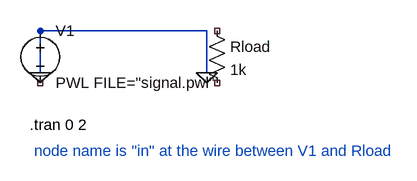
[diagram p0: schematic wav_source.asc]
wav_source.asc, the LTspice schematic file:
Version 4
SHEET 1 880 680
WIRE 224 176 96 176
WIRE 352 176 224 176
WIRE 96 240 96 176
WIRE 352 240 352 176
FLAG 96 240 0
SYMBOL voltage 96 160 R0
SYMATTR InstName V1
SYMATTR Value PWL FILE="signal.pwl"
SYMBOL res 352 160 R0
SYMATTR InstName Rload
SYMATTR Value 1k
FLAG 352 240 0
TEXT 80 320 Left 2 !.tran 0 2
TEXT 80 360 Left 2 ; node name is "in" at the wire between V1 and Rload

The netlist it stands for:
* wav_source.asc
V1 0 NC_01 PWL FILE="signal.pwl"
Rload NC_02 NC_03 1k
.tran 0 2
*  node name is "in" at the wire between V1 and Rload
.backanno
.end